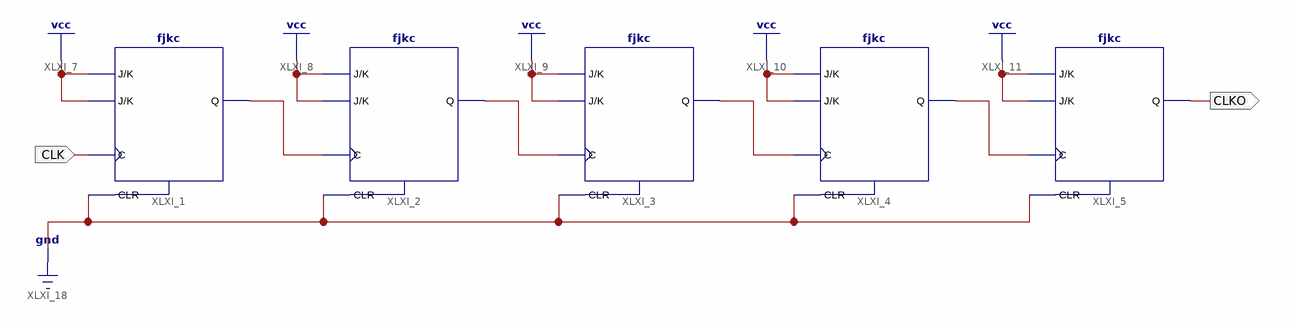
[diagram p0: schematic sheet 1]
// Xilinx ISE schematic clkdiv32.sch (spartan6) as structural Verilog: 5 symbols, 2 ports
module clkdiv32 (
  input  CLK,
  output CLKO
);

  wire XLXN_1, XLXN_2, XLXN_3, XLXN_5;

  fjkc XLXI_1 (.C(CLK), .CLR(1'b0), .J(1'b1), .K(1'b1), .Q(XLXN_1));
  fjkc XLXI_2 (.C(XLXN_1), .CLR(1'b0), .J(1'b1), .K(1'b1), .Q(XLXN_2));
  fjkc XLXI_3 (.C(XLXN_2), .CLR(1'b0), .J(1'b1), .K(1'b1), .Q(XLXN_3));
  fjkc XLXI_4 (.C(XLXN_3), .CLR(1'b0), .J(1'b1), .K(1'b1), .Q(XLXN_5));
  fjkc XLXI_5 (.C(XLXN_5), .CLR(1'b0), .J(1'b1), .K(1'b1), .Q(CLKO));
endmodule
